# Altium schematic sheet NMEA Power.SchDoc
size A; SheetNumber: 8; SheetTotal: 11
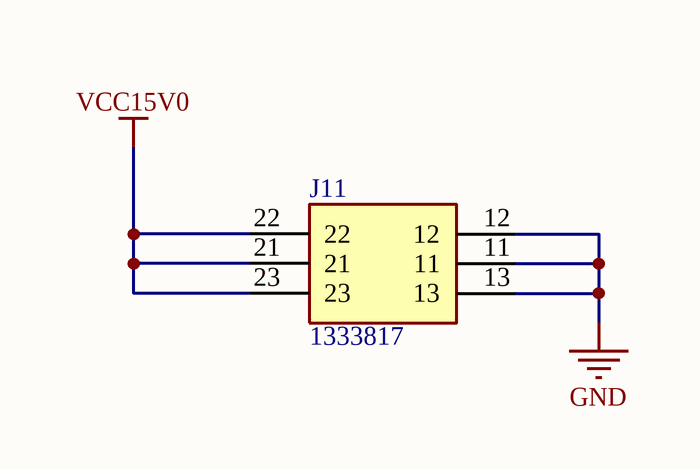
[diagram p0: NMEA Power.SchDoc]

## Parts
J11  1333817  [1333817]

## Nets
GND: J11.11 J11.12 J11.13
VCC15V0: J11.21 J11.22 J11.23

## Library data of the parts
J11 = 1333817: Pluggable Terminal Blocks LPTA 16/ 2-10,0-ZB; Manufacturer_Name: Phoenix Contact; Geometry.Height: 46.4mm; Mouser Part Number: 651-1333817; Mouser Price/Stock: https://www.mouser.co.uk/ProductDetail/Phoenix-Contact/1333817?qs=Jm2GQyTW%2Fbi%252BbQzIAqu7ww%3D%3D; Manufacturer_Part_Number: 1333817; Datasheet Link: https://www.phoenixcontact.com/en-pc/products/pcb-terminal-block-lpta-16-2-100-zb-1333817